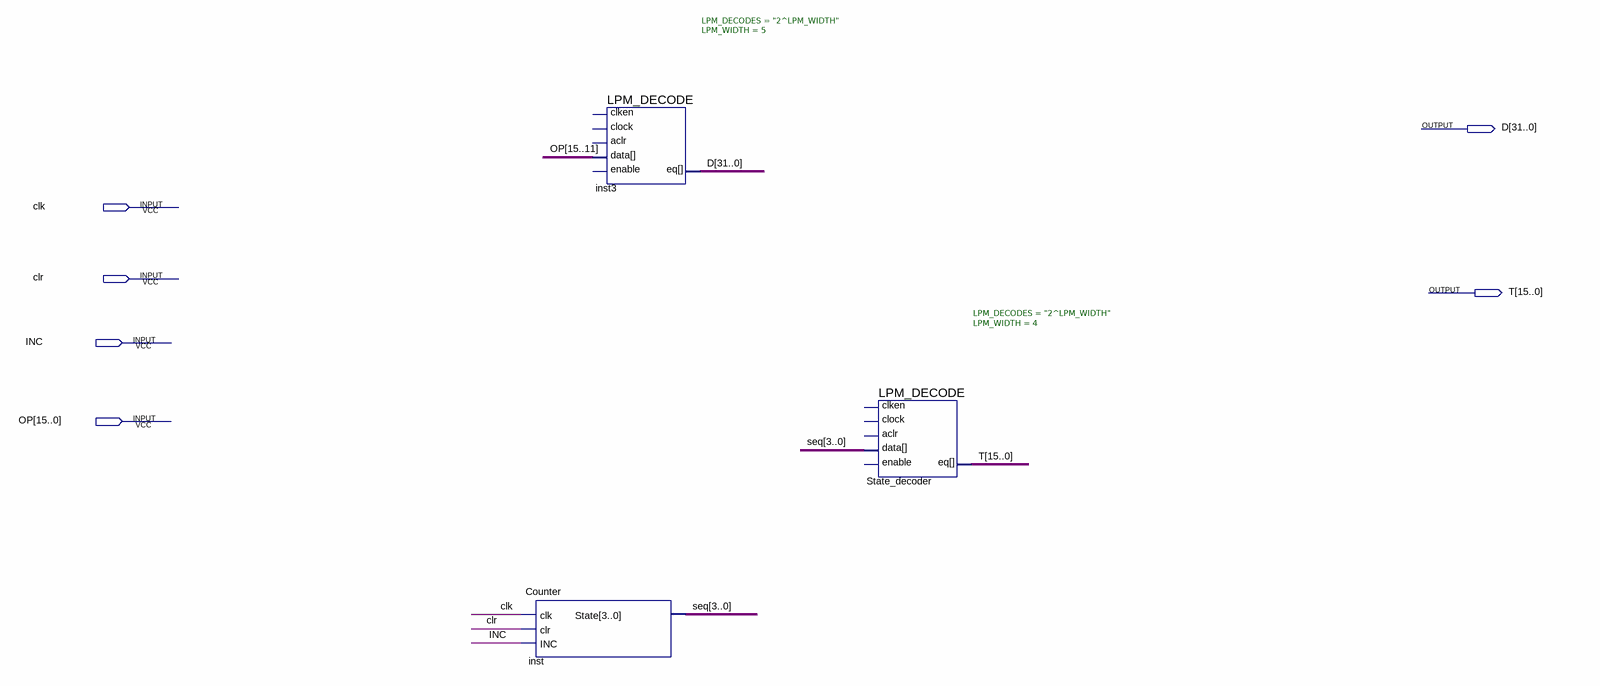
[diagram p0: schematic sheet]
// Quartus schematic CU_input_handler.bdf as structural Verilog: 3 symbols, 6 pins
module CU_input_handler (
  input  clk,
  input  clr,
  input  INC,
  input  [15:0] OP,
  output [31:0] D,
  output [15:0] T
);

  wire [3:0] seq;

  Counter inst (.clk(clk), .clr(clr), .INC(INC), .State(seq));
  LPM_DECODE #(.LPM_DECODES("2^LPM_WIDTH"), .LPM_WIDTH(5)) inst3 (
    .data(OP[15:11]), .eq(D));  // open: enable, clken, clock, aclr
  LPM_DECODE #(.LPM_DECODES("2^LPM_WIDTH"), .LPM_WIDTH(4)) State_decoder (
    .data(seq), .eq(T));  // open: enable, clken, clock, aclr
endmodule
